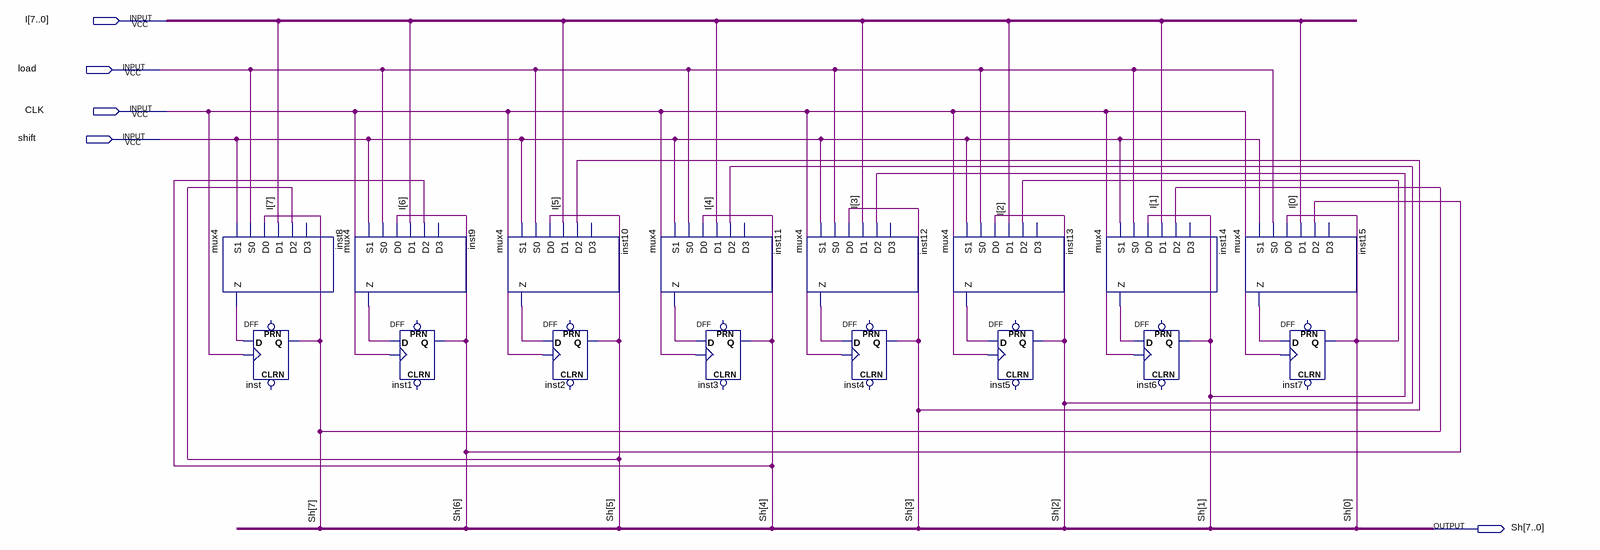
[diagram p0: schematic sheet]
// Quartus schematic shift_2.bdf as structural Verilog: 16 symbols, 5 pins
module shift_2 (
  input  [7:0] I,
  input  load,
  input  CLK,
  input  shift,
  output [7:0] Sh
);

  wire inst8_z, inst9_z, inst10_z, inst11_z, inst12_z, inst13_z, inst14_z, inst15_z;

  mux4 inst8 (.S1(shift), .S0(load), .D0(Sh[7]), .D1(I[7]), .D2(Sh[5]), .Z(inst8_z));  // open: D3
  DFF inst (.CLK(CLK), .D(inst8_z), .Q(Sh[7]));  // open: CLRN, PRN
  mux4 inst9 (.S1(shift), .S0(load), .D0(Sh[6]), .D1(I[6]), .D2(Sh[4]), .Z(inst9_z));  // open: D3
  DFF inst1 (.CLK(CLK), .D(inst9_z), .Q(Sh[6]));  // open: CLRN, PRN
  mux4 inst10 (.S1(shift), .S0(load), .D0(Sh[5]), .D1(I[5]), .D2(Sh[3]), .Z(inst10_z));  // open: D3
  DFF inst2 (.CLK(CLK), .D(inst10_z), .Q(Sh[5]));  // open: CLRN, PRN
  mux4 inst11 (.S1(shift), .S0(load), .D0(Sh[4]), .D1(I[4]), .D2(Sh[2]), .Z(inst11_z));  // open: D3
  DFF inst3 (.CLK(CLK), .D(inst11_z), .Q(Sh[4]));  // open: CLRN, PRN
  mux4 inst12 (.S1(shift), .S0(load), .D0(Sh[3]), .D1(I[3]), .D2(Sh[1]), .Z(inst12_z));  // open: D3
  DFF inst4 (.CLK(CLK), .D(inst12_z), .Q(Sh[3]));  // open: CLRN, PRN
  mux4 inst13 (.S1(shift), .S0(load), .D0(Sh[2]), .D1(I[2]), .D2(Sh[0]), .Z(inst13_z));  // open: D3
  DFF inst5 (.CLK(CLK), .D(inst13_z), .Q(Sh[2]));  // open: CLRN, PRN
  mux4 inst14 (.S1(shift), .S0(load), .D0(Sh[1]), .D1(I[1]), .D2(Sh[7]), .Z(inst14_z));  // open: D3
  DFF inst6 (.CLK(CLK), .D(inst14_z), .Q(Sh[1]));  // open: CLRN, PRN
  mux4 inst15 (.S1(shift), .S0(load), .D0(Sh[0]), .D1(I[0]), .D2(Sh[6]), .Z(inst15_z));  // open: D3
  DFF inst7 (.CLK(CLK), .D(inst15_z), .Q(Sh[0]));  // open: CLRN, PRN
endmodule
